# EAGLE design PAL13579 (EAGLE 6.6.0)
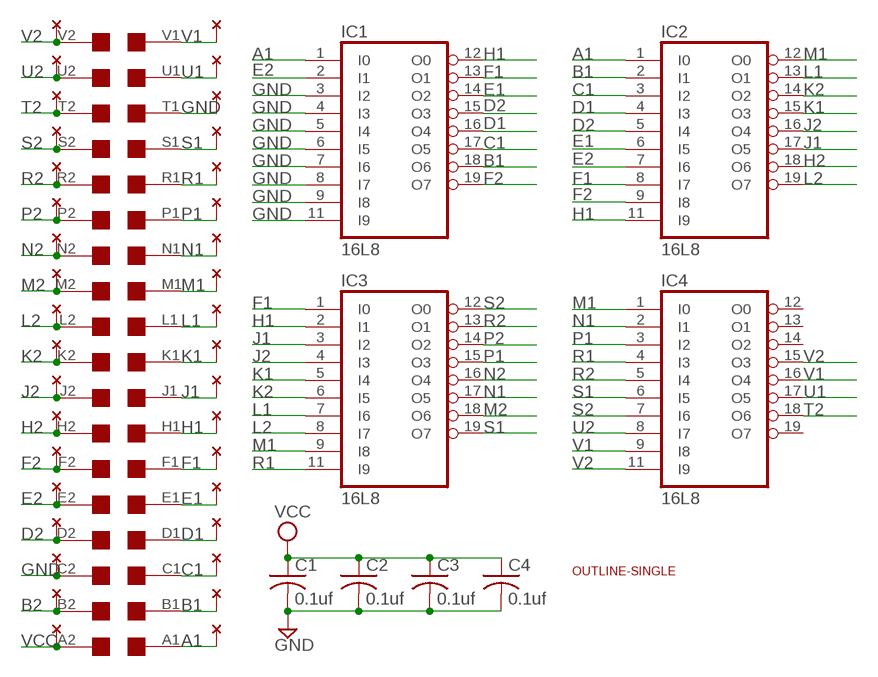
[diagram p0: schematic, sheet 1]

## Parts
C1  0.1uf  C-US050-025X075  [C050-025X075]
C2  0.1uf  C-US050-025X075  [C050-025X075]
C3  0.1uf  C-US050-025X075  [C050-025X075]
C4  0.1uf  C-US050-025X075  [C050-025X075]
IC1  16L8  [DIL20]
IC2  16L8  [DIL20]
IC3  16L8  [DIL20]
IC4  16L8  [DIL20]
U$1  EDGE-2CONNECTOR  [EDGE-CON2]
U$2  OUTLINE-SINGLE  [SINGLE]
U$4  THRU-HOLE2A  [THRU-HOLEA]

## Nets
A1: IC1.1(I0) IC2.1(I0) U$1.A1 U$4.A1
B1: IC1.18(O6) IC2.2(I1) U$1.B1 U$4.B1
B2: U$1.B2 U$4.B2
C1: IC1.17(O5) IC2.3(I2) U$1.C1 U$4.C1
D1: IC1.16(O4) IC2.4(I3) U$1.D1 U$4.D1
D2: IC1.15(O3) IC2.5(I4) U$1.D2 U$4.D2
E1: IC1.14(O2) IC2.6(I5) U$1.E1 U$4.E1
E2: IC1.2(I1) IC2.7(I6) U$1.E2 U$4.E2
F1: IC1.13(O1) IC2.8(I7) IC3.1(I0) U$1.F1 U$4.F1
F2: IC1.19(O7) IC2.9(I8) U$1.F2 U$4.F2
GND [supply]: C1.2 C2.2 C3.2 C4.2 IC1.3(I2) IC1.4(I3) IC1.5(I4) IC1.6(I5) IC1.7(I6) IC1.8(I7) IC1.9(I8) IC1.11(I9) U$1.C2 U$1.T1 U$4.C2 U$4.T1
H1: IC1.12(O0) IC2.11(I9) IC3.2(I1) U$1.H1 U$4.H1
H2: IC2.18(O6) U$1.H2 U$4.H2
J1: IC2.17(O5) IC3.3(I2) U$1.J1 U$4.J1
J2: IC2.16(O4) IC3.4(I3) U$1.J2 U$4.J2
K1: IC2.15(O3) IC3.5(I4) U$1.K1 U$4.K1
K2: IC2.14(O2) IC3.6(I5) U$1.K2 U$4.K2
L1: IC2.13(O1) IC3.7(I6) U$1.L1 U$4.L1
L2: IC2.19(O7) IC3.8(I7) U$1.L2 U$4.L2
M1: IC2.12(O0) IC3.9(I8) IC4.1(I0) U$1.M1 U$4.M1
M2: IC3.18(O6) U$1.M2 U$4.M2
N1: IC3.17(O5) IC4.2(I1) U$1.N1 U$4.N1
N2: IC3.16(O4) U$1.N2 U$4.N2
P1: IC3.15(O3) IC4.3(I2) U$1.P1 U$4.P1
P2: IC3.14(O2) U$1.P2 U$4.P2
R1: IC3.11(I9) IC4.4(I3) U$1.R1 U$4.R1
R2: IC3.13(O1) IC4.5(I4) U$1.R2 U$4.R2
S1: IC3.19(O7) IC4.6(I5) U$1.S1 U$4.S1
S2: IC3.12(O0) IC4.7(I6) U$1.S2 U$4.S2
T2: IC4.18(O6) U$1.T2 U$4.T2
U1: IC4.17(O5) U$1.U1 U$4.U1
U2: IC4.8(I7) U$1.U2 U$4.U2
V1: IC4.9(I8) IC4.16(O4) U$1.V1 U$4.V1
V2: IC4.11(I9) IC4.15(O3) U$1.V2 U$4.V2
VCC [supply]: C1.1 C2.1 C3.1 C4.1 U$1.A2 U$4.A2
Unconnected: IC4.12(O0) IC4.13(O1) IC4.14(O2) IC4.19(O7)

## Power pins joined to a net without a drawn wire
GND: IC1.10(GND) IC2.10(GND) IC3.10(GND) IC4.10(GND)
VCC: IC1.20(VCC) IC2.20(VCC) IC3.20(VCC) IC4.20(VCC)

## Library data of the parts
C1-C4 = rcl:C-US: CAPACITOR, American symbol
IC1-IC4 = pal:16L8: PAL; MF: TEXAS INSTRUMENTS; MPN: TIBPAL16L8-7CN; OC_FARNELL: 1510033; OC_NEWARK: 08F8522
U$1 = dec-con:EDGE-2: Double-Sided DEC edge connector.
U$2 = dec-con:OUTLINE-*: Board outlines for DEC boards.
U$4 = dec-con:THRU-HOLE2: Thru-Hole addition to double-sided edge connector.

## Net classes
1 supply: width 0.381 mm

## Board
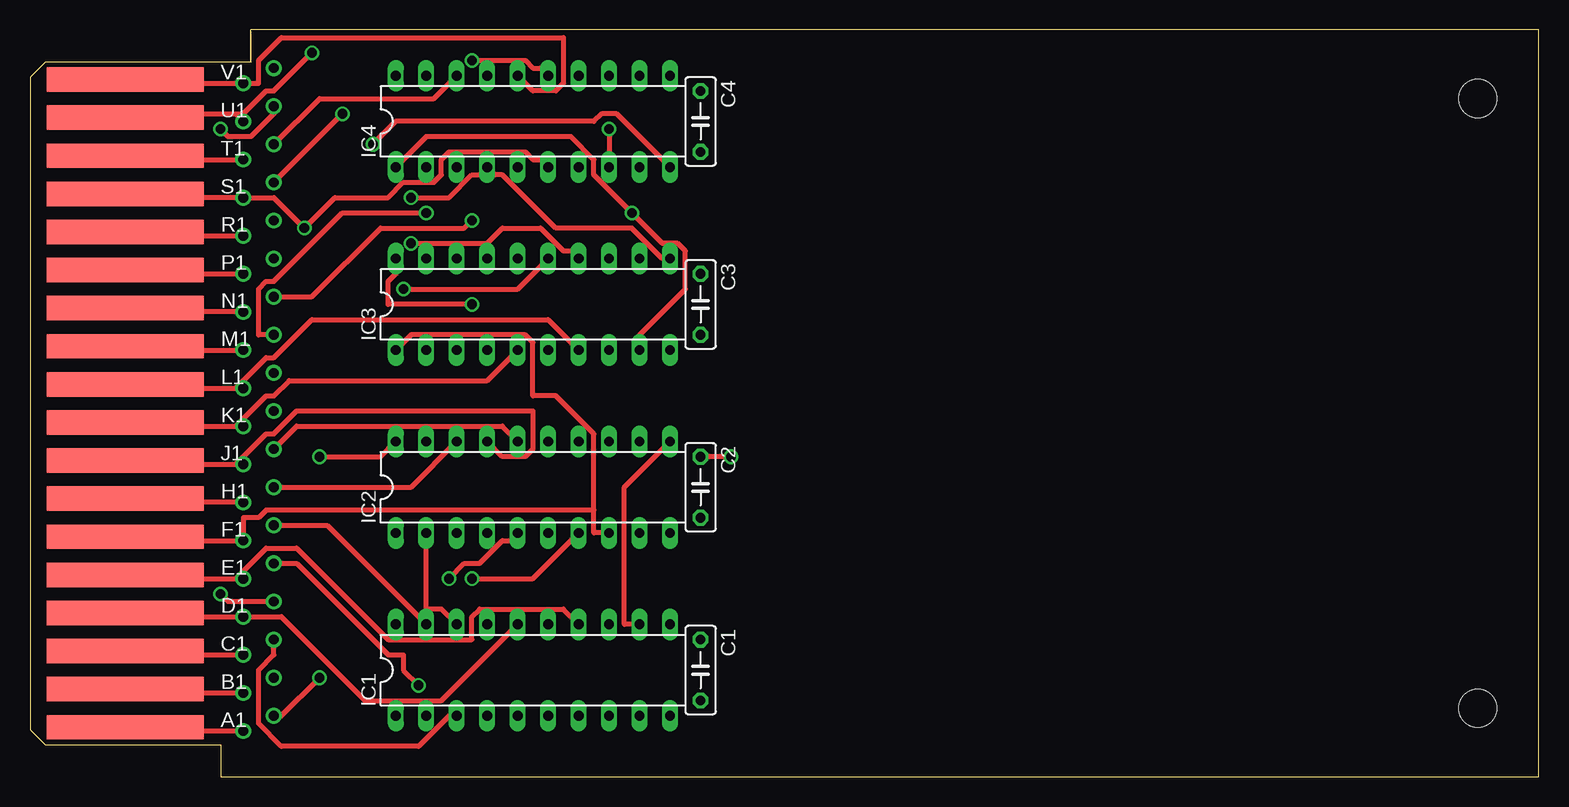
[diagram p1: board, top side]
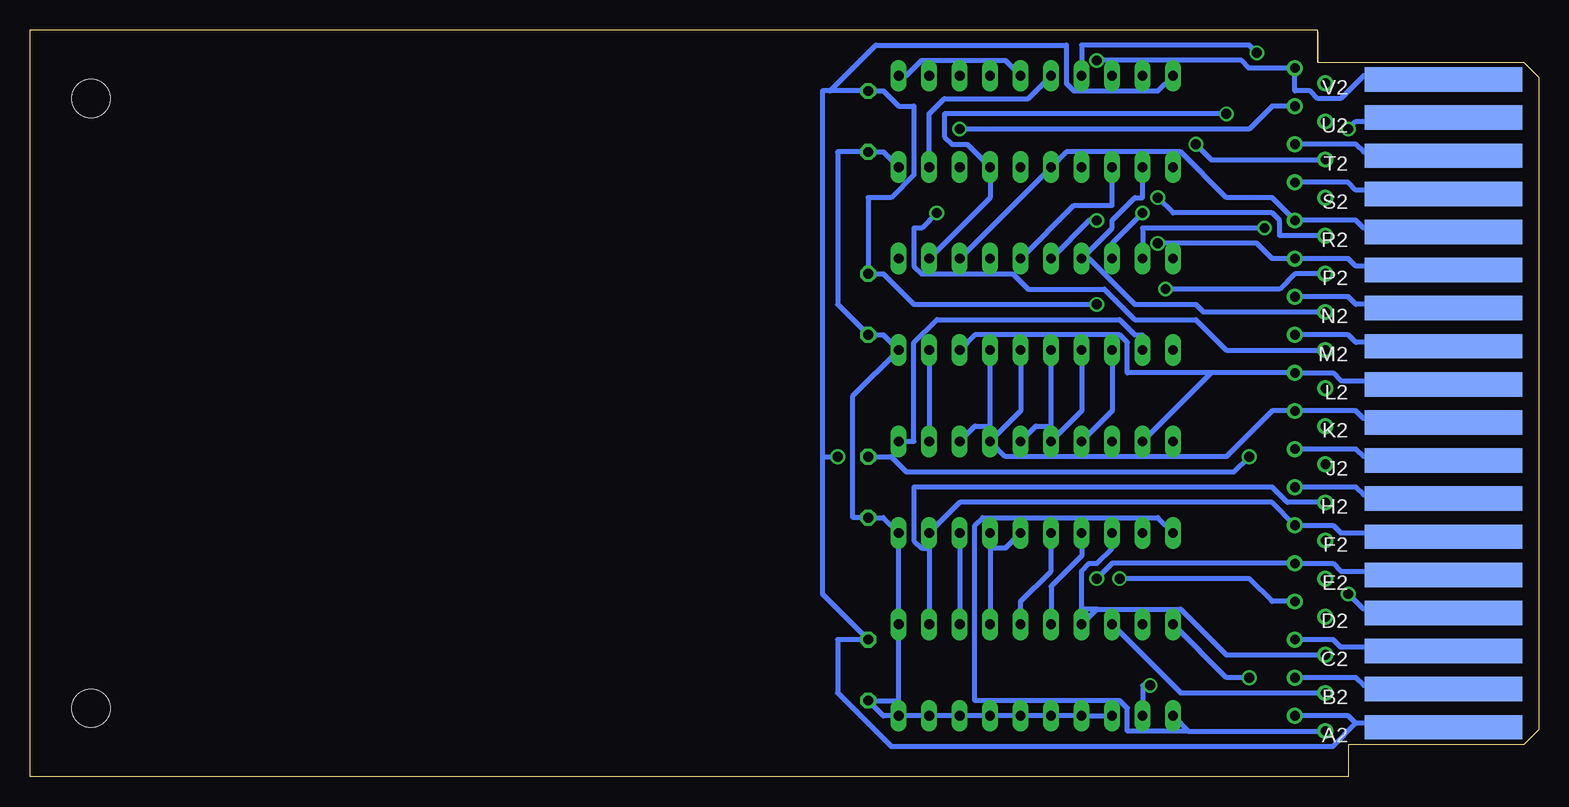
[diagram p2: board, bottom side, seen from below]

Size 125.73 x 62.23 mm. Coordinates in mm from the lower left corner, seen from the top.
Copper layers (1+16): Top 0.035mm / dielectric 1.5mm / Bottom 0.035mm
Design rules "16mils": minimum track width 16mil, minimum drill 32mil, track to track 15mil, track to pad 10mil, pad to pad 10mil, via to via 10mil, smd to smd 10mil, copper to edge 13mil, drill to drill 10mil, minimum pad ring 10mil, minimum via ring 8mil, stop-mask expansion 0mil, vias tented up to drill 0mil, thermal gap 10mil

### Footprints (pad centres in the part's own frame; a part is rotated, then mirrored left to right if it is on the bottom)
C050-025X075 = drill 0.813 octagon: 1 -2.54,0; 2 2.54,0
DIL20 = drill 0.813 long: 1 -11.43,-3.81; 2 -8.89,-3.81; 3 -6.35,-3.81; 4 -3.81,-3.81; 5 -1.27,-3.81; 6 1.27,-3.81; 7 3.81,-3.81; 8 6.35,-3.81; 9 8.89,-3.81; 10 11.43,-3.81; 11 11.43,3.81; 12 8.89,3.81; 13 6.35,3.81; 14 3.81,3.81; 15 1.27,3.81; 16 -1.27,3.81; 17 -3.81,3.81; 18 -6.35,3.81; 19 -8.89,3.81; 20 -11.43,3.81
EDGE-CON2 = smd 13.106 x 2.032: A1 7.938,4.128; B1 7.938,7.303; C1 7.938,10.477; D1 7.938,13.652; E1 7.938,16.828; F1 7.938,20.003; H1 7.938,23.177; J1 7.938,26.352; K1 7.938,29.527; L1 7.938,32.703; M1 7.938,35.877; N1 7.938,39.053; P1 7.938,42.227; R1 7.938,45.403; S1 7.938,48.578; T1 7.938,51.752; U1 7.938,54.928; V1 7.938,58.102 | smd 13.106 x 2.032 bottom: A2 7.938,4.128; B2 7.938,7.303; C2 7.938,10.477; D2 7.938,13.652; E2 7.938,16.828; F2 7.938,20.003; H2 7.938,23.177; J2 7.938,26.352; K2 7.938,29.527; L2 7.938,32.703; M2 7.938,35.877; N2 7.938,39.053; P2 7.938,42.227; R2 7.938,45.403; S2 7.938,48.578; T2 7.938,51.752; U2 7.938,54.928; V2 7.938,58.102
SINGLE = hole 3.175: 120.65,56.515; 120.65,5.715
THRU-HOLEA = drill 0.813 pad 1.27: A1 17.78,3.81; A2 20.32,5.08; B1 17.78,6.985; B2 20.32,8.255; C1 17.78,10.16; C2 20.32,11.43; D1 17.78,13.335; D2 20.32,14.605; E1 17.78,16.51; E2 20.32,17.78; F1 17.78,19.685; F2 20.32,20.955; H1 17.78,22.86; H2 20.32,24.13; J1 17.78,26.035; J2 20.32,27.305; K1 17.78,29.21; K2 20.32,30.48; L1 17.78,32.385; L2 20.32,33.655; M1 17.78,35.56; M2 20.32,36.83; N1 17.78,38.735; N2 20.32,40.005; P1 17.78,41.91; P2 20.32,43.18; R1 17.78,45.085; R2 20.32,46.355; S1 17.78,48.26; S2 20.32,49.53; T1 17.78,51.435; T2 20.32,52.705; U1 17.78,54.61; U2 20.32,55.88; V1 17.78,57.785; V2 20.32,59.055

### Placement (x,y rotation side)
C1  55.88,8.89 270 top
C2  55.88,24.13 270 top
C3  55.88,39.37 270 top
C4  55.88,54.61 270 top
IC1  41.91,8.89 0 top
IC2  41.91,24.13 0 top
IC3  41.91,39.37 0 top
IC4  41.91,54.61 0 top
U$1  0,0 0 top
U$2  0,0 0 top
U$4  0,0 0 top

### Tracks (layer width: path | path; a pad name or v marks a point on that pad's centre or on a via)
A1
  Top 0.406: U$4.A1 8.26,3.81 U$1.A1
  Bottom 0.406: 29.21,3.81 U$4.A1 | IC1.1 29.21,3.81 | IC2.1 31.75,21.59 46.36,21.59 46.99,20.95 46.99,6.35 34.93,6.35 34.29,5.71 34.29,3.81 29.21,3.81
B1
  Top 0.406: IC2.2 33.02,13.97 34.29,13.97 IC1.18 | U$4.B1 8.26,6.99 U$1.B1
  Bottom 0.406: U$4.B1 29.85,6.99 IC1.18
B2
  Bottom 0.406: U$4.B2 15.24,8.26 14.61,7.62 8.26,7.62 U$1.B2
C1
  Top 0.406: U$4.C1 8.26,10.16 U$1.C1
  Bottom 0.406: U$4.C1 26.04,10.16 29.85,13.97 36.83,13.97 | IC1.17 36.83,13.97 | IC2.3 35.56,19.05 36.83,17.78 37.47,17.78 38.1,17.14 38.1,13.97 36.83,13.97
D1
  Top 0.406: U$1.D1 8.26,13.34 U$4.D1 20.96,13.34 27.94,6.35 34.29,6.35 IC1.16
  Bottom 0.406: IC1.16 40.64,15.88 38.1,18.41 IC2.4
D2  (via drill 0.81)
  Top 0.406: U$4.D2 16.51,14.61 v15.88,15.24 | IC2.5 40.01,19.68 39.37,19.68 37.47,17.78 36.2,17.78 v34.93,16.51
  Bottom 0.406: IC2.5 40.64,17.14 43.18,14.61 IC1.15 | v15.88,15.24 14.61,13.97 8.26,13.97 U$1.D2 | v34.93,16.51 24.13,16.51 22.23,14.61 U$4.D2
E1
  Top 0.406: 17.15,16.51 8.26,16.51 U$1.E1 | IC1.14 44.45,13.97 37.47,13.97 36.83,13.34 36.83,11.43 29.85,11.43 22.23,19.05 19.69,19.05 17.15,16.51 | 17.15,16.51 U$4.E1
  Bottom 0.406: IC1.14 45.72,19.05 44.45,19.05 IC2.6
E2  (via drill 0.81)
  Top 0.406: v32.39,7.62 31.12,8.89 31.12,10.16 29.85,10.16 22.23,17.78 U$4.E2 | IC2.7 41.91,16.51 v36.83,16.51
  Bottom 0.406: IC1.2 33.02,7.62 v32.39,7.62 | v36.83,16.51 35.56,17.78 U$4.E2 17.15,17.78 16.51,17.14 8.26,17.14 U$1.E2
F1
  Top 0.406: U$1.F1 8.26,19.68 U$4.F1 17.78,21.59 19.05,21.59 19.69,22.23 46.99,22.23 | IC3.1 31.75,36.83 41.28,36.83 41.91,36.2 41.91,31.75 43.82,31.75 46.99,28.57 46.99,22.23 | 46.99,22.23 46.99,20.32 IC2.8
  Bottom 0.406: IC2.8 IC1.13
F2
  Top 0.406: IC1.19 24.77,20.95 U$4.F2
  Bottom 0.406: IC2.9 48.26,22.86 22.23,22.86 U$4.F2 17.15,20.95 16.51,20.32 8.26,20.32 U$1.F2
GND  (via drill 0.81)
  Top 0.406: U$4.T1 8.26,51.44 U$1.T1 | v28.58,52.7 30.48,54.61 46.99,54.61 47.63,55.24 48.9,55.24 IC4.10 | U$4.C2 20.32,10.16 19.05,8.89 19.05,4.45 20.96,2.54 32.39,2.54 34.93,5.08 IC1.3
  Bottom 0.406: U$4.C2 17.15,11.43 16.51,10.79 8.26,10.79 U$1.C2 | IC4.10 54.61,52.07 C4.2 58.42,52.07 58.42,39.37 C3.2 54.61,36.83 IC3.10 57.15,31.75 57.15,21.59 C2.2 54.61,21.59 IC2.10 IC1.11 53.34,6.35 C1.2 54.61,5.08 IC1.10 IC1.9 IC1.8 IC1.7 IC1.6 IC1.5 IC1.4 IC1.3 | U$4.T1 27.31,51.44 v28.58,52.7
H1
  Top 0.406: IC2.11 49.53,24.13 49.53,12.7 IC1.12 | U$4.H1 8.26,22.86 U$1.H1
  Bottom 0.406: IC3.2 33.02,36.83 33.66,36.83 34.93,38.1 50.17,38.1 52.07,36.2 52.07,27.94 IC2.11 | IC1.12 50.8,19.05 51.44,19.05 52.07,19.68 52.07,24.13 22.23,24.13 20.96,22.86 U$4.H1
H2
  Top 0.406: IC2.18 31.75,24.13 U$4.H2
  Bottom 0.406: U$4.H2 15.24,24.13 14.61,23.5 8.26,23.5 U$1.H2
J1
  Top 0.406: 17.15,26.04 8.26,26.04 U$1.J1 | IC2.17 39.37,26.67 41.28,26.67 41.91,27.3 41.91,30.48 22.23,30.48 20.32,28.57 19.69,28.57 17.15,26.04 | 17.15,26.04 U$4.J1
  Bottom 0.406: IC2.17 35.56,30.48 IC3.3
J2
  Top 0.406: IC2.16 39.37,29.21 22.23,29.21 U$4.J2
  Bottom 0.406: IC2.16 38.1,30.48 IC3.4 | U$4.J2 15.24,27.3 14.61,26.67 8.26,26.67 U$1.J2
K1
  Top 0.406: 17.15,29.21 8.26,29.21 U$1.K1 | IC3.5 38.1,33.02 21.59,33.02 20.32,31.75 19.69,31.75 17.15,29.21 | 17.15,29.21 U$4.K1
  Bottom 0.406: IC3.5 40.64,29.21 41.91,29.21 IC2.15
K2
  Bottom 0.406: IC3.6 43.18,30.48 IC2.14 44.45,26.67 26.04,26.67 22.23,30.48 U$4.K2 15.24,30.48 14.61,29.84 8.26,29.84 U$1.K2
L1
  Top 0.406: 17.15,32.38 8.26,32.38 U$1.L1 | IC3.7 43.18,38.1 23.5,38.1 20.32,34.92 19.69,34.92 17.15,32.38 | 17.15,32.38 U$4.L1
  Bottom 0.406: IC3.7 45.72,29.21 46.99,29.21 IC2.13
L2
  Bottom 0.406: 27.31,33.66 IC2.19 | 27.31,33.66 U$4.L2 17.15,33.66 16.51,33.02 8.26,33.02 U$1.L2 | IC3.8 46.99,36.83 34.93,36.83 34.29,36.2 34.29,33.66 27.31,33.66
M1  (via drill 0.81)
  Top 0.406: U$4.M1 8.26,35.56 U$1.M1 | IC4.1 33.02,53.34 45.09,53.34 46.99,51.44 46.99,50.16 v50.17,46.99 52.71,44.45 53.98,44.45 54.61,43.81 54.61,40.64 50.8,36.83 IC3.9
  Bottom 0.406: IC3.9 IC2.12 | U$4.M1 26.04,35.56 28.58,38.1 33.66,38.1 36.2,40.64 42.55,40.64 43.82,41.91 51.44,41.91 52.07,42.55 52.07,45.72 51.44,45.72 v50.17,46.99
M2  (via drill 0.81)
  Top 0.406: v33.02,46.99 26.04,46.99 20.32,41.27 19.69,41.27 19.05,40.64 19.05,36.83 U$4.M2
  Bottom 0.406: U$4.M2 15.88,36.83 15.24,36.2 8.26,36.2 U$1.M2 | IC3.18 35.56,44.45 v33.02,46.99
N1
  Top 0.406: U$4.N1 8.26,38.73 U$1.N1
  Bottom 0.406: U$4.N1 27.94,38.73 28.58,39.37 33.66,39.37 37.47,43.18 IC3.17 35.56,45.72 35.56,46.35 33.66,48.26 33.02,48.26 IC4.2
N2  (via drill 0.81)
  Top 0.406: v36.83,46.35 36.2,45.72 29.21,45.72 23.5,40.01 U$4.N2
  Bottom 0.406: U$4.N2 15.88,40.01 15.24,39.37 8.26,39.37 U$1.N2 | IC3.16 37.47,46.35 v36.83,46.35
P1  (via drill 0.81)
  Top 0.406: U$4.P1 8.26,41.91 U$1.P1 | IC3.15 40.64,40.64 v31.12,40.64
  Bottom 0.406: IC4.3 35.56,47.62 38.74,47.62 IC3.15 | v31.12,40.64 21.59,40.64 20.32,41.91 U$4.P1
P2  (via drill 0.81)
  Top 0.406: IC3.14 45.09,43.81 44.45,43.81 42.55,45.72 39.37,45.72 38.1,44.45 v31.75,44.45
  Bottom 0.406: U$1.P2 8.26,42.55 15.24,42.55 15.88,43.18 U$4.P2 22.23,43.18 23.5,44.45 v31.75,44.45
R1  (via drill 0.81)
  Top 0.406: IC3.11 52.71,43.18 50.17,45.72 43.82,45.72 39.37,50.16 38.74,50.16 IC4.4 37.47,50.16 36.83,50.16 34.93,48.26 v31.75,48.26 | U$4.R1 8.26,45.09 U$1.R1
  Bottom 0.406: v31.75,48.26 30.48,46.99 22.23,46.99 21.59,46.35 21.59,45.09 U$4.R1
R2
  Bottom 0.406: IC3.13 IC4.5 39.37,52.07 29.85,52.07 26.04,48.26 22.23,48.26 U$4.R2 15.24,46.35 14.61,45.72 8.26,45.72 U$1.R2
S1  (via drill 0.81)
  Top 0.406: IC4.6 42.55,51.44 41.91,51.44 41.28,52.07 34.93,52.07 34.29,51.44 34.29,50.16 33.66,49.53 31.12,49.53 29.85,48.26 25.4,48.26 v22.86,45.72 20.32,48.26 U$4.S1 8.26,48.26 U$1.S1
  Bottom 0.406: IC3.19 33.02,45.72 v22.86,45.72
S2  (via drill 0.81)
  Top 0.406: U$4.S2 v26.04,55.24
  Bottom 0.406: IC3.12 45.72,48.26 IC4.7 47.63,52.7 48.9,52.7 49.53,53.34 49.53,55.24 v26.04,55.24 | U$4.S2 15.88,49.53 15.24,48.9 8.26,48.9 U$1.S2
T2
  Top 0.406: IC4.18 33.66,56.52 24.13,56.52 U$4.T2
  Bottom 0.406: U$4.T2 15.24,52.7 14.61,52.07 8.26,52.07 U$1.T2
U1  (via drill 0.81)
  Top 0.406: 17.15,55.24 U$4.U1 | 17.15,55.24 8.26,55.24 U$1.U1 | v23.5,60.33 20.32,57.15 19.69,57.15 17.78,55.24 17.15,55.24
  Bottom 0.406: IC4.17 38.1,60.96 24.13,60.96 v23.5,60.33
U2  (via drill 0.81)
  Top 0.406: v48.26,53.98 IC4.8 | v15.88,53.98 16.51,53.34 18.42,53.34 20.32,55.24 U$4.U2
  Bottom 0.406: v48.26,53.98 24.13,53.98 22.23,55.88 U$4.U2 | v15.88,53.98 15.24,54.61 8.26,54.61 U$1.U2
V1
  Top 0.406: U$1.V1 8.26,57.78 U$4.V1 19.05,57.78 19.05,59.69 20.96,61.59 44.45,61.59 44.45,57.78 43.82,57.15 41.91,57.15 IC4.16
  Bottom 0.406: IC4.16 42.55,56.52 49.53,56.52 50.8,55.24 IC4.9
V2  (via drill 0.81)
  Top 0.406: IC4.15 42.55,59.05 41.91,59.05 41.28,59.69 v36.83,59.69
  Bottom 0.406: IC4.15 44.45,59.69 51.44,59.69 52.71,58.42 IC4.11 | U$1.V2 8.26,58.42 14.61,58.42 16.51,56.52 18.42,56.52 19.05,57.15 20.32,57.15 U$4.V2 24.13,59.05 24.77,59.69 v36.83,59.69
VCC  (via drill 0.81)
  Top 0.406: v24.13,8.26 20.96,5.08 U$4.A2 | v58.42,26.67 C2.1 | IC2.20 29.21,26.67 v24.13,26.67 | IC3.20 30.48,41.91 29.85,41.27 29.85,39.37 v36.83,39.37
  Bottom 0.406: U$4.A2 15.88,5.08 15.24,4.45 | 15.24,4.45 8.26,4.45 U$1.A2 | IC1.20 26.04,8.26 v24.13,8.26 | 59.69,26.67 59.69,57.15 59.06,57.15 | 59.69,26.67 59.69,15.24 C1.1 58.42,11.43 58.42,6.99 53.98,2.54 17.15,2.54 15.24,4.45 | 59.06,57.15 C4.1 54.61,57.15 53.34,55.88 52.07,55.88 52.07,50.16 53.98,48.26 55.88,48.26 C3.1 54.61,41.91 52.07,39.37 v36.83,39.37 | 59.69,26.67 v58.42,26.67 | v24.13,26.67 25.4,25.4 52.71,25.4 53.98,26.67 C2.1 | IC4.20 31.75,57.15 38.74,57.15 39.37,57.78 39.37,60.96 55.25,60.96 59.06,57.15